# EAGLE design example (EAGLE 9.6.2)
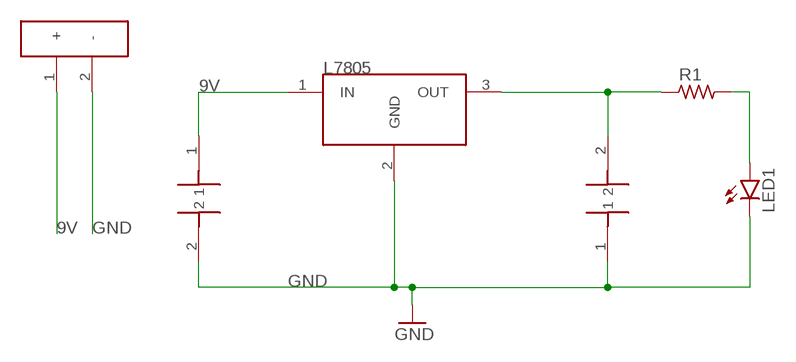
[diagram p0: schematic, sheet 1]

## Parts
LED1  LEDCHIP-LED0805  [CHIP-LED0805]
R1  R_1206  [R1206]
U$1  L7805A  [L7805]
U$2  2X1KLAMENSA  [2X1KLAMENS]
U$3  0.1UF  [C1206]
U$4  0.33UF  [C1206]

## Nets
9V: U$1.1(IN) U$2.1(+) U$3.1
GND: LED1.C U$1.2(GND) U$2.2(-) U$3.2 U$4.1
N$3: R1.1 U$1.3(OUT) U$4.2
N$4: LED1.A R1.2

## Library data of the parts
LED1 = led:LED: LED OSRAM: - CHIPLED LG R971, LG N971, LY N971, LG Q971, LY Q971, LO R971, LY R971 LH N974, LH R974 LS Q976, LO Q976, LY Q976 LO Q996 - Hyper CHIPLED LW Q18S LB Q993, LB Q99A, LB R99A - SideLED LS A670, LO A670, LY A670, LG A670, LP A670 LB A673, LV A673, LT A673, LW A673 LH A674 LY A675 LS A676, LA A676, LO A676, LY A676, LW A676 LS A679, LY A679, LG A679 - Hyper Micro SIDELED® LS Y876, LA Y876, LO Y876, LY Y876 LT Y87S - SmartLED LW L88C, LW L88S LB L89C, LB L89S, LG L890 LS L89K, LO L89K, LY L89K LS L896, LA L896, LO L896, LY L896 - TOPLED LS T670, LO T670, LY T670, LG T670, LP T670 LSG T670, LSP T670, LSY T670, LOP T670, LYG T670 LG T671, LOG T671, LSG T671 LB T673, LV T673, LT T673, LW T673 LH T674 LS T676, LA T676, LO T676, LY T676, LB T676, LH T676, LSB T676, LW T676 LB T67C, LV T67C, LT T67C, LS T67K, LO T67K, LY T67K, LW E67C LS E67B, LA E67B, LO E67B, LY E67B, LB E67C, LV E67C, LT E67C LW T67C LS T679, LY T679, LG T679 LS T770, LO T770, LY T770, LG T770, LP T770 LB T773, LV T773, LT T773, LW T773 LH T774 LS E675, LA E675, LY E675, LS T675 LS T776, LA T776, LO T776, LY T776, LB T776 LHGB T686 LT T68C, LB T68C - Hyper Mini TOPLED® LB M676 - Mini TOPLED Santana® LG M470 LS M47K, LO M47K, LY M47K Source: http://www.osram.convergy.de LUXEON: - LUMILED® LXK2-PW12-R00, LXK2-PW12-S00, LXK2-PW14-U00, LXK2-PW14-V00 LXK2-PM12-R00, LXK2-PM12-S00, LXK2-PM14-U00 LXK2-PE12-Q00, LXK2-PE12-R00, LXK2-PE12-S00, LXK2-PE14-T00, LXK2-PE14-U00 LXK2-PB12-K00, LXK2-PB12-L00, LXK2-PB12-M00, LXK2-PB14-N00, LXK2-PB14-P00, LXK2-PB14-Q00 LXK2-PR12-L00, LXK2-PR12-M00, LXK2-PR14-Q00, LXK2-PR14-R00 LXK2-PD12-Q00, LXK2-PD12-R00, LXK2-PD12-S00 LXK2-PH12-R00, LXK2-PH12-S00 LXK2-PL12-P00, LXK2-PL12-Q00, LXK2-PL12-R00 Source: www.luxeon.com KINGBRIGHT: KA-3528ASYC Source: www.kingbright.com
R1 = cap_master-smd:R_: RESISTOR
U$1 = example_regulator_lib:L7805
U$2 = example_regulator_lib:2X1KLAMENS
U$3 = example_regulator_lib:0.1UF
U$4 = example_regulator_lib:0.33UF

## Board
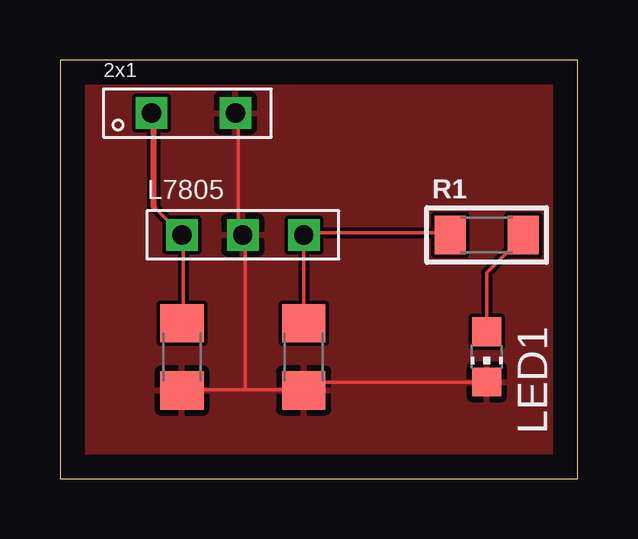
[diagram p1: board, top side]

Size 21.57 x 17.45 mm. Coordinates in mm from the lower left corner, seen from the top.
Outline: 0,0 21.57,0 21.57,17.45 0,17.45 0,0
Copper layers (1*16): Top 0.035mm / dielectric 1.5mm / Bottom 0.035mm
Design rules "default": minimum track width 6mil, minimum drill 0.35mm, track to track 6mil, track to pad 6mil, pad to pad 6mil, via to via 6mil, smd to smd 6mil, copper to edge 40mil, drill to drill 6mil, minimum pad ring 10mil, minimum via ring 8mil, stop-mask expansion 4mil, vias tented up to drill 0mil, thermal gap 10mil

### Footprints (pad centres in the part's own frame; a part is rotated, then mirrored left to right if it is on the bottom)
CHIP-LED0805 = smd 1.2 x 1.2: A 0,-1.05; C 0,1.05
R1206 = smd 1.3 x 1.6: 1 -1.524,0; 2 1.524,0
L7805 = drill 0.8 pad 1.27 square: 1 -2.54,0; 2 0,0; 3 2.54,0
2X1KLAMENS = drill 0.8 pad 1.27 square: 1 0,0; 2 3.5,0
C1206 = smd 1.6 x 1.8: 1 -1.4,0; 2 1.4,0

### Placement (x,y rotation side)
LED1  17.78,5.08 180 top
R1  17.78,10.16 0 top
U$1  7.62,10.16 0 top
U$2  3.81,15.24 0 top
U$3  5.08,5.08 270 top
U$4  10.16,5.08 90 top

### Tracks (layer width: path | path; a pad name or v marks a point on that pad's centre or on a via)
9V
  Top 0.152: U$3.1 5.13,6.6 5.13,10.11 U$1.1 3.91,11.33 | 3.91,15.14 U$2.1
  Top 0.254: 3.91,11.33 3.91,15.14
GND
  Top 0.152: U$2.2 7.42,15.14 7.42,10.41 7.57,10.26 U$1.2 7.72,10.11 7.72,3.71 | 10.16,3.71 10.46,4.01 17.78,4.01 LED1.C | 10.16,3.71 7.72,3.71 | 7.72,3.71 5.13,3.71 U$3.2 | 10.16,3.71 U$4.1
  pour Top: 0,17.78 0,0 21.59,0 21.59,17.78
N$3
  Top 0.152: R1.1 16.26,10.26 10.16,10.26 U$1.3 U$4.2
N$4
  Top 0.152: LED1.A 17.78,8.59 19.3,10.11 R1.2